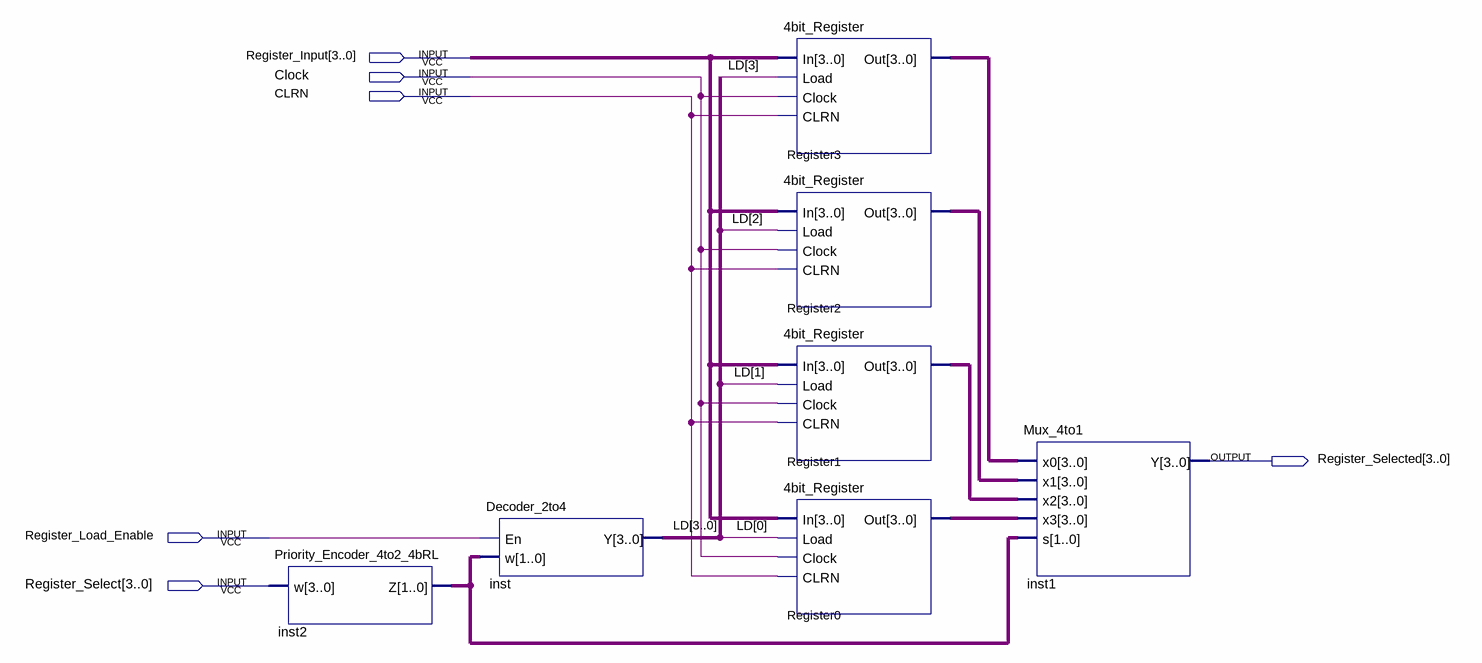
[diagram p0: schematic sheet]
// Quartus schematic 4_4bit_Register_File.bdf as structural Verilog: 7 symbols, 6 pins
module \4_4bit_Register_File  (
  input  [3:0] Register_Input,
  input  Clock,
  input  CLRN,
  input  Register_Load_Enable,
  input  [3:0] Register_Select,
  output [3:0] Register_Selected
);

  wire [1:0] inst2_z;
  wire [3:0] LD, Register0_out, Register1_out, Register2_out, Register3_out;

  Priority_Encoder_4to2_4bRL inst2 (.w(Register_Select), .Z(inst2_z));
  Decoder_2to4 inst (.En(Register_Load_Enable), .w(inst2_z), .Y(LD));
  \4bit_Register  Register3 (.In(Register_Input), .Load(LD[3]), .Clock(Clock), .CLRN(CLRN), .Out(Register3_out));
  \4bit_Register  Register2 (.In(Register_Input), .Load(LD[2]), .Clock(Clock), .CLRN(CLRN), .Out(Register2_out));
  \4bit_Register  Register1 (.In(Register_Input), .Load(LD[1]), .Clock(Clock), .CLRN(CLRN), .Out(Register1_out));
  \4bit_Register  Register0 (.In(Register_Input), .Load(LD[0]), .Clock(Clock), .CLRN(CLRN), .Out(Register0_out));
  Mux_4to1 inst1 (
    .x0(Register3_out), .x1(Register2_out), .x2(Register1_out), .x3(Register0_out), .s(inst2_z),
    .Y(Register_Selected));
endmodule
